# Altium schematic sheet [04]Misc IO.SchDoc
size A
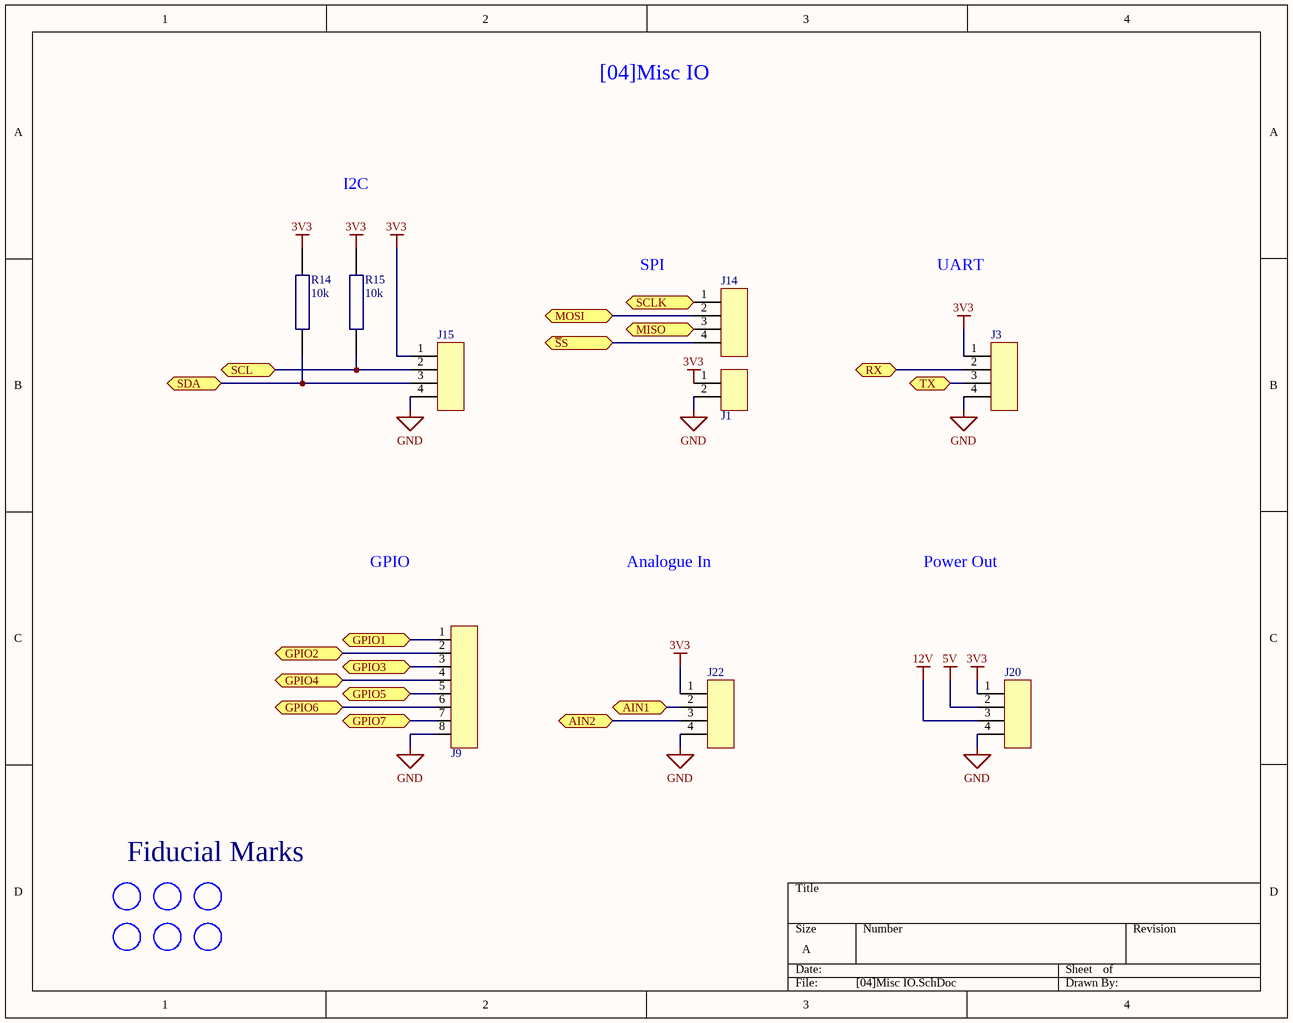
[diagram p0: [04]Misc IO.SchDoc]

## Parts
FID1  FID?  [fiducial]  (value not drawn)
FID2  FID?  [fiducial]  (value not drawn)
FID3  FID?  [fiducial]  (value not drawn)
FID4  FID?  [fiducial]  (value not drawn)
FID5  FID?  [fiducial]  (value not drawn)
FID6  FID?  [fiducial]  (value not drawn)
J1  282834-2  [282834-2]  (value not drawn)
J3  282834-4  [282834-4]  (value not drawn)
J9  1771156  [1771156]  (value not drawn)
J14  282834-4  [282834-4]  (value not drawn)
J15  282834-4  [282834-4]  (value not drawn)
J20  282834-4  [282834-4]  (value not drawn)
J22  282834-4  [282834-4]  (value not drawn)
R14  10k  [RESC2012X07N_SAMSUNG]
R15  10k  [RESC2012X07N_SAMSUNG]

## Ports
AIN1 (bidir), AIN2 (bidir), GPIO1 (bidir), GPIO2 (bidir), GPIO3 (bidir), GPIO4 (bidir), GPIO5 (bidir), GPIO6 (bidir), GPIO7 (bidir), MISO (bidir), MOSI (bidir), RX (bidir), SCL (bidir), SCLK (bidir), SDA (bidir), TX (bidir), ~{S}S (bidir)

## Nets
3V3: J1.1 J3.1 J15.1 J20.1 J22.1 R14.2 R15.2
5V: J20.2
12V: J20.3
GND: J1.2 J3.4 J9.8 J15.4 J20.4 J22.4
~{S}S: J14.4 ; port ~{S}S
AIN1: J22.2 ; port AIN1
AIN2: J22.3 ; port AIN2
GPIO1: J9.1 ; port GPIO1
GPIO2: J9.2 ; port GPIO2
GPIO3: J9.3 ; port GPIO3
GPIO4: J9.4 ; port GPIO4
GPIO5: J9.5 ; port GPIO5
GPIO6: J9.6 ; port GPIO6
GPIO7: J9.7 ; port GPIO7
MISO: J14.3 ; port MISO
MOSI: J14.2 ; port MOSI
RX: J3.2 ; port RX
SCL: J15.2 R15.1 ; port SCL
SCLK: J14.1 ; port SCLK
SDA: J15.3 R14.1 ; port SDA
TX: J3.3 ; port TX

## Notes on the sheet
- [04]Misc IO
- I2C
- SPI
- UART
- GPIO
- Analogue In
- Power Out
- Fiducial Marks

## Library data of the parts
FID1-FID6 = fiducial
J1 = 282834-2: 2 Position Wire to Board Terminal Block; Supplier 1: Digi-Key; Supplier Part Number 1: A98333-ND
J3 J14 J15 J20 J22 = 282834-4: 4 Position Wire to Board Terminal Block; Supplier 1: Digi-Key; Supplier Part Number 1: A98335-ND
J9 = 1771156: CONN TERM BLK 8POS 2.5MM SMD; Manufacturer: Phoenix Contact; Positions Per Level: 8; Pitch: 0.098" (2.50mm); Mating Orientation: Vertical with Board; Wire Gauge: 20-26 AWG; Wire Termination: Screwless - Spring Cage, Tension Clamp; Supplier 1: Digi-Key; Manufacturer Part Number: 1771156; RoHS: RoHS Compliant; Category: Connectors, Interconnects; Stock 1: 2856; Pricing 1: 1=1.39, 10=1.334, 50=1.276, 100=1.2412 (USD); Packaging: Cut Tape (CT); Part Status: Active; Mounting Type: Surface Mount; Features: Solder Retention; Color: Black; Operating Temperature: -; Housing Material: Liquid Crystal Polymer (LCP); Contact Material - Plating: -; Clamp Material - Plating: -; Screw Material - Plating: -; Torque - Screw: -; Screw Thread: -; ComponentLink1URL: https://media.digikey.com/pdf/Data%20Sheets/Phoenix%20Contact%20PDFs/1771156.pdf; ComponentLink1Description: https://media.digikey.com/pdf/Data%20Sheets/Phoenix%20Contact%20PDFs/1771156.pdf; Supplier Part Number 1: 277-2078-1-ND
R14 R15 = RC2012F103CS: RES SMD 10K OHM 1% 1/8W 0805; Manufacturer: Samsung Electro-Mechanics America, Inc.; Power (Watts): 0.125W, 1/8W; Temperature Coefficient: ±100ppm/°C; Manufacturer Part Number: RC2012F103CS; RoHS: RoHS Compliant; Category: Resistors; Packaging: Cut Tape (CT); Resistance (Ohms): 10k; Tolerance: ±1%; Composition: Thick Film; Features: Moisture Resistant; Operating Temperature: -55°C ~ 155°C; Package / Case: 0805 (2012 Metric); Supplier Device Package: 0805 (2012 Metric); Size / Dimension: 0.079" L x 0.049" W (2.00mm x 1.25mm); Height: 0.024" (0.60mm); Number of Terminations: 2; ComponentLink1URL: http://media.digikey.com/pdf/Data%20Sheets/Samsung%20PDFs/RC_Series_ds.pdf; ComponentLink1Description: http://media.digikey.com/pdf/Data%20Sheets/Samsung%20PDFs/RC_Series_ds.pdf; Supplier 1: Digi-Key; Supplier Part Number 1: 1276-5332-1-ND